# EAGLE schematic slickv2 (EAGLE 7.6.0)
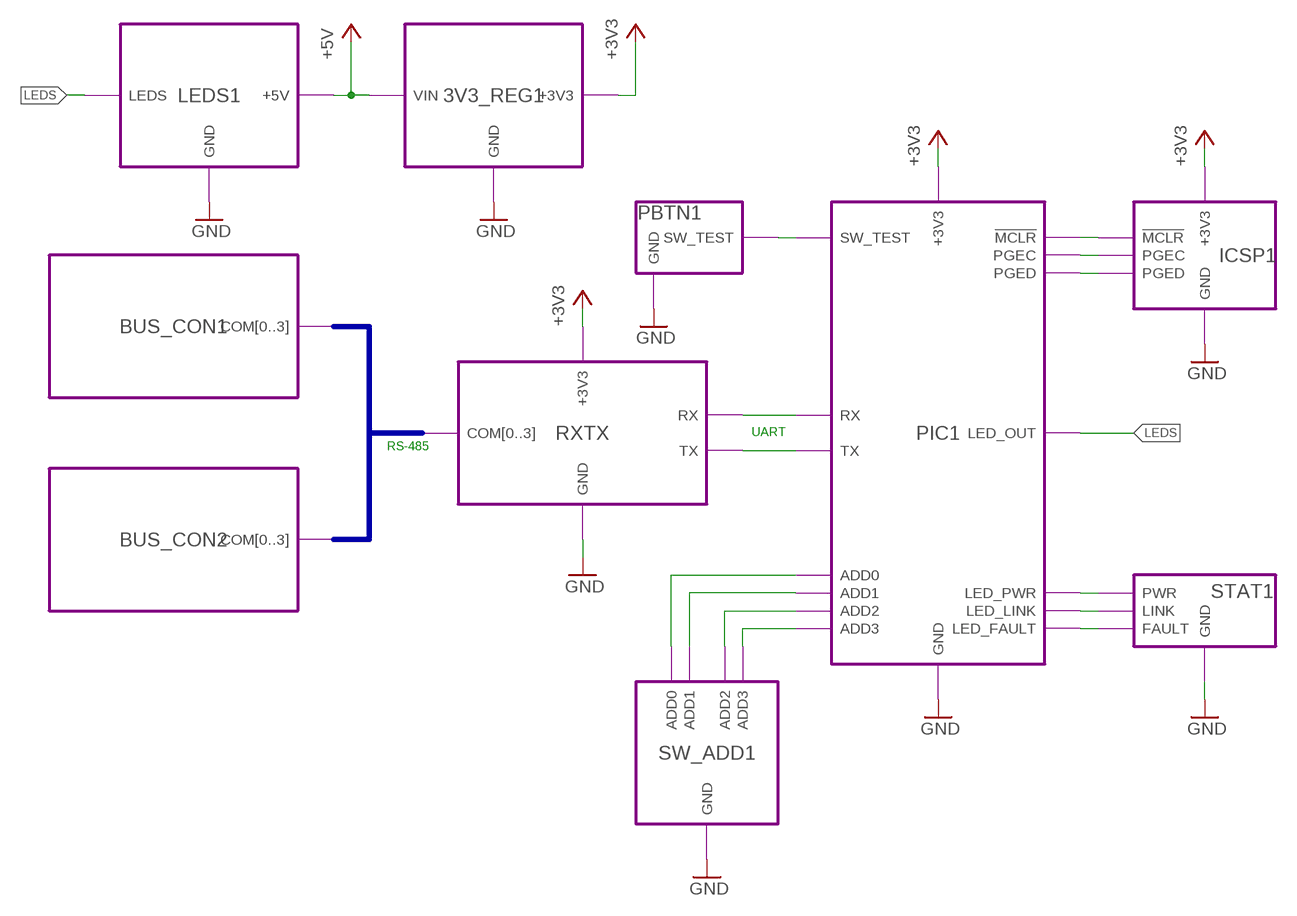
[diagram p0: schematic, sheet 1]

## Module instances
STAT1 = STATUS_LEDS
3V3_REG1 = 3V3_REGULATOR
LEDS1 = LED_CONNECTOR
BUS_CON1 = BUS_CONNECTOR
BUS_CON2 = BUS_CONNECTOR
RXTX = TRANSCEIVER
PIC1 = CONTROLLER
ICSP1 = ICSP_CON
SW_ADD1 = ADD_SELECTOR
PBTN1 = TEST_SWITCH

## Nets
+3V3: port 3V3_REG1.+3V3 RXTX.+3V3 ICSP1.+3V3 PIC1.+3V3
+5V: port LEDS1.+5V 3V3_REG1.VIN
GND: port LEDS1.GND 3V3_REG1.GND RXTX.GND PIC1.GND STAT1.GND ICSP1.GND SW_ADD1.GND PBTN1.GND
LEDS: port LEDS1.LEDS PIC1.LED_OUT
N$1: port RXTX.RX PIC1.RX
N$2: port RXTX.TX PIC1.TX
N$3: port PIC1.LED_PWR STAT1.PWR
N$4: port PIC1.LED_LINK STAT1.LINK
N$5: port PIC1.LED_FAULT STAT1.FAULT
N$6: port ICSP1.!MCLR PIC1.!MCLR
N$7: port PIC1.PGEC ICSP1.PGEC
N$8: port PIC1.PGED ICSP1.PGED
N$9: port SW_ADD1.ADD3 PIC1.ADD3
N$10: port SW_ADD1.ADD2 PIC1.ADD2
N$11: port PIC1.ADD1 SW_ADD1.ADD1
N$12: port SW_ADD1.ADD0 PIC1.ADD0
N$13: port PBTN1.SW_TEST PIC1.SW_TEST

## Buses
COM
COM[0..3]

## Notes on the sheet
- UART
- RS-485

## Library data of the parts

## Module STATUS_LEDS
Ports: PWR(in) LINK(in) FAULT(in) GND(pwr)
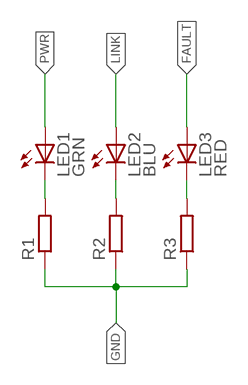
[diagram p1: schematic, module STATUS_LEDS, sheet 1]

### Parts
LED1  GRN  LED3MM  [LED3MM]
LED2  BLU  LED3MM  [LED3MM]
LED3  RED  LED3MM  [LED3MM]
R1  R-EU_R0805  [R0805]
R2  R-EU_R0805  [R0805]
R3  R-EU_R0805  [R0805]

### Nets
FAULT: LED3.A
GND: R1.1 R2.1 R3.1
LINK: LED2.A
N$1: LED1.K(C) R1.2
N$2: LED2.K(C) R2.2
N$3: LED3.K(C) R3.2
PWR: LED1.A

### Library data of the parts
LED1-LED3 = led:LED: LED OSRAM: - CHIPLED LG R971, LG N971, LY N971, LG Q971, LY Q971, LO R971, LY R971 LH N974, LH R974 LS Q976, LO Q976, LY Q976 LO Q996 - Hyper CHIPLED LW Q18S LB Q993, LB Q99A, LB R99A - SideLED LS A670, LO A670, LY A670, LG A670, LP A670 LB A673, LV A673, LT A673, LW A673 LH A674 LY A675 LS A676, LA A676, LO A676, LY A676, LW A676 LS A679, LY A679, LG A679 - Hyper Micro SIDELED® LS Y876, LA Y876, LO Y876, LY Y876 LT Y87S - SmartLED LW L88C, LW L88S LB L89C, LB L89S, LG L890 LS L89K, LO L89K, LY L89K LS L896, LA L896, LO L896, LY L896 - TOPLED LS T670, LO T670, LY T670, LG T670, LP T670 LSG T670, LSP T670, LSY T670, LOP T670, LYG T670 LG T671, LOG T671, LSG T671 LB T673, LV T673, LT T673, LW T673 LH T674 LS T676, LA T676, LO T676, LY T676, LB T676, LH T676, LSB T676, LW T676 LB T67C, LV T67C, LT T67C, LS T67K, LO T67K, LY T67K, LW E67C LS E67B, LA E67B, LO E67B, LY E67B, LB E67C, LV E67C, LT E67C LW T67C LS T679, LY T679, LG T679 LS T770, LO T770, LY T770, LG T770, LP T770 LB T773, LV T773, LT T773, LW T773 LH T774 LS E675, LA E675, LY E675, LS T675 LS T776, LA T776, LO T776, LY T776, LB T776 LHGB T686 LT T68C, LB T68C - Hyper Mini TOPLED® LB M676 - Mini TOPLED Santana® LG M470 LS M47K, LO M47K, LY M47K Source: http://www.osram.convergy.de LUXEON: - LUMILED® LXK2-PW12-R00, LXK2-PW12-S00, LXK2-PW14-U00, LXK2-PW14-V00 LXK2-PM12-R00, LXK2-PM12-S00, LXK2-PM14-U00 LXK2-PE12-Q00, LXK2-PE12-R00, LXK2-PE12-S00, LXK2-PE14-T00, LXK2-PE14-U00 LXK2-PB12-K00, LXK2-PB12-L00, LXK2-PB12-M00, LXK2-PB14-N00, LXK2-PB14-P00, LXK2-PB14-Q00 LXK2-PR12-L00, LXK2-PR12-M00, LXK2-PR14-Q00, LXK2-PR14-R00 LXK2-PD12-Q00, LXK2-PD12-R00, LXK2-PD12-S00 LXK2-PH12-R00, LXK2-PH12-S00 LXK2-PL12-P00, LXK2-PL12-Q00, LXK2-PL12-R00 Source: www.luxeon.com KINGBRIGHT: KA-3528ASYC Source: www.kingbright.com
R1-R3 = rcl:R-EU_: RESISTOR, European symbol

## Module 3V3_REGULATOR
Ports: VIN(in) +3V3(out) GND(pwr)
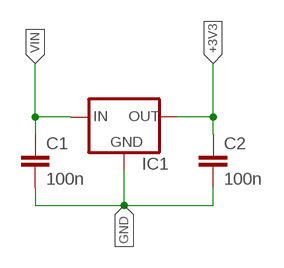
[diagram p2: schematic, module 3V3_REGULATOR, sheet 1]

### Parts
C1  100n  C-EUC1206  [C1206]
C2  100n  C-EUC1206  [C1206]
IC1  LP2950ACZ-3.3  [TO92]

### Nets
+3V3: C2.1 IC1.1(OUT)
GND: C1.2 C2.2 IC1.2(GND)
VIN: C1.1 IC1.3(IN)

### Library data of the parts
C1 C2 = rcl:C-EU: CAPACITOR, European symbol
IC1 = v-reg:LP2950?*: Source: http://cache.national.com/ds/LP/LP2950.pdf

## Module LED_CONNECTOR
Ports: LEDS(in) +5V(out) GND(pwr)
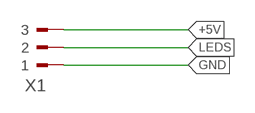
[diagram p3: schematic, module LED_CONNECTOR, sheet 1]

### Parts
X1  90G-3  [90G-3]

### Nets
+5V: X1.3
GND: X1.1
LEDS: X1.2

### Library data of the parts
X1 = con-weidmueller-sl35:90G-3: WEIDMUELLER CLAMP CONNECTOR; OC_FARNELL: unknown; OC_NEWARK: unknown

## Module BUS_CONNECTOR
Ports: COM[0..3](io)
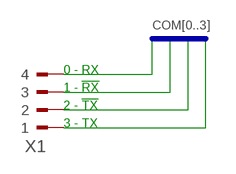
[diagram p4: schematic, module BUS_CONNECTOR, sheet 1]

### Parts
X1  90G-4  [90G-4]

### Nets
COM0: X1.4
COM1: X1.3
COM2: X1.2
COM3: X1.1

### Buses
COM[0..3]

### Notes on the sheet
- 0 - RX
- 1 - !RX
- 2 - !TX
- 3 - TX

### Library data of the parts
X1 = con-weidmueller-sl35:90G-4: WEIDMUELLER CLAMP CONNECTOR; OC_FARNELL: unknown; OC_NEWARK: unknown

## Module TRANSCEIVER
Ports: COM[0..3](io) RX(out) TX(in) GND(pwr) +3V3(pwr)
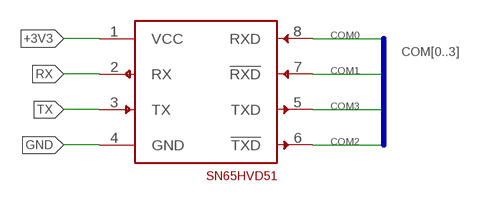
[diagram p5: schematic, module TRANSCEIVER, sheet 1]

### Parts
U$1  SN65HVD51  [SO-08]

### Nets
+3V3: U$1.1(VCC)
COM0: U$1.8(RXD)
COM1: U$1.7(!RXD)
COM2: U$1.6(!TXD)
COM3: U$1.5(TXD)
GND: U$1.4(GND)
RX: U$1.2(RX)
TX: U$1.3(TX)

### Buses
COM[0..3]

### Library data of the parts
U$1 = SN65HVD51:SN65HVD51

## Module CONTROLLER
Ports: RX(in) TX(out) +3V3(pwr) GND(pwr) LED_FAULT(out) LED_LINK(out) LED_PWR(out) ADD3(in) ADD2(in) ADD1(in) ADD0(in) !MCLR(in) PGEC(in) PGED(in) LED_OUT(out) SW_TEST(in)
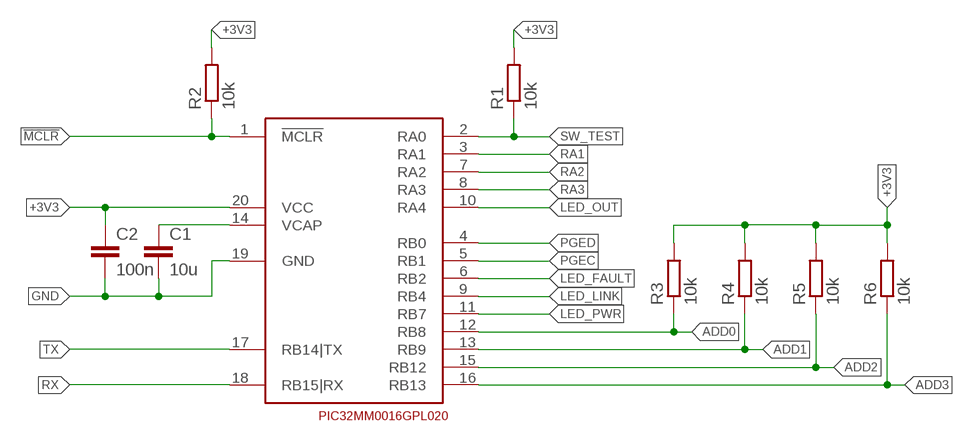
[diagram p6: schematic, module CONTROLLER, sheet 1]

### Parts
C1  10u  C-EUC1206  [C1206]
C2  100n  C-EUC1206  [C1206]
R1  10k  R-EU_M0805  [M0805]
R2  10k  R-EU_M0805  [M0805]
R3  10k  R-EU_M0805  [M0805]
R4  10k  R-EU_M0805  [M0805]
R5  10k  R-EU_M0805  [M0805]
R6  10k  R-EU_M0805  [M0805]
U$1  PIC32MM0016GPL020  [SSOP20]

### Nets
!MCLR: R2.1 U$1.1(!MCLR)
+3V3: C2.1 R1.2 R2.2 R3.2 R4.2 R5.2 R6.2 U$1.20(VCC)
ADD0: R3.1 U$1.12(RB8)
ADD1: R4.1 U$1.13(RB9)
ADD2: R5.1 U$1.15(RB12)
ADD3: R6.1 U$1.16(RB13)
GND: C1.2 C2.2 U$1.19(GND)
LED_FAULT: U$1.6(RB2)
LED_LINK: U$1.9(RB4)
LED_OUT: U$1.10(RA4)
LED_PWR: U$1.11(RB7)
N$6: C1.1 U$1.14(VCAP)
PGEC: U$1.5(RB1)
PGED: U$1.4(RB0)
RA1: U$1.3(RA1)
RA2: U$1.7(RA2)
RA3: U$1.8(RA3)
RX: U$1.18(RB15|RX)
SW_TEST: R1.1 U$1.2(RA0)
TX: U$1.17(RB14|TX)

### Library data of the parts
C1 C2 = rcl:C-EU: CAPACITOR, European symbol
R1-R6 = rcl:R-EU_: RESISTOR, European symbol
U$1 = PIC32MM0016GPL020:PIC32MM0016GPL020

## Module ICSP_CON
Ports: !MCLR(out) PGEC(out) PGED(out) GND(pwr) +3V3(pwr)
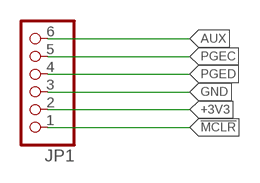
[diagram p7: schematic, module ICSP_CON, sheet 1]

### Parts
JP1  PINHD-1X6  [1X06]

### Nets
!MCLR: JP1.1
+3V3: JP1.2
AUX: JP1.6
GND: JP1.3
PGEC: JP1.5
PGED: JP1.4

### Library data of the parts
JP1 = pinhead:PINHD-1X6: PIN HEADER

## Module ADD_SELECTOR
Ports: ADD3(out) ADD2(out) ADD1(out) ADD0(out) GND(pwr)
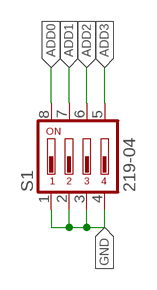
[diagram p8: schematic, module ADD_SELECTOR, sheet 1]

### Parts
S1  219-04  [CTS-219-04]

### Nets
ADD0: S1.8
ADD1: S1.7
ADD2: S1.6
ADD3: S1.5
GND: S1.1 S1.2 S1.3 S1.4

### Library data of the parts
S1 = switch-dil:219-04*: Surface Mount DIP Switch Series 219 SMT CTS Electronic Components Sourc: www.ctscorp.com; OC_FARNELL: unknown; OC_NEWARK: unknown

## Module TEST_SWITCH
Ports: SW_TEST(out) GND(pwr)
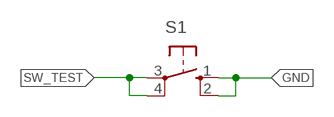
[diagram p9: schematic, module TEST_SWITCH, sheet 1]

### Parts
S1  10-XX  [B3F-10XX]

### Nets
GND: S1.1(S) S1.2(S1)
SW_TEST: S1.3(P) S1.4(P1)

### Library data of the parts
S1 = switch-omron:10-XX: OMRON SWITCH; MPN: B3F-1000; OC_FARNELL: 176432; OC_NEWARK: 36M3542

## Net classes
0 default: clearance 0.205 mm